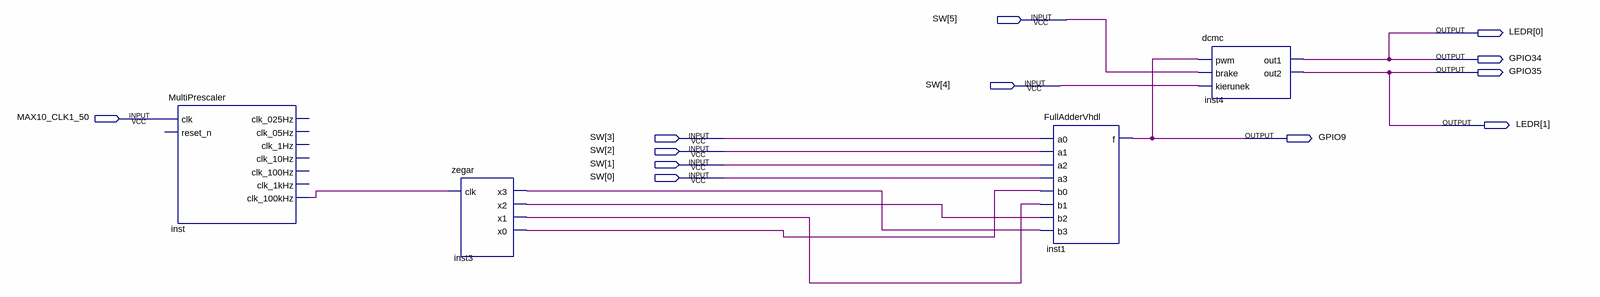
[diagram p0: schematic sheet]
// Quartus schematic PWM.bdf as structural Verilog: 4 symbols, 12 pins
module PWM (
  input  [5:0] SW,
  input  MAX10_CLK1_50,
  output [1:0] LEDR,
  output GPIO34,
  output GPIO35,
  output GPIO9
);

  wire inst3_x0, inst3_x1, inst3_x2, inst3_x3, inst_clk_100khz;

  MultiPrescaler inst (
    .clk(MAX10_CLK1_50), .clk_100kHz(inst_clk_100khz));  // open: reset_n, clk_025Hz, clk_05Hz, clk_1Hz, clk_10Hz, clk_100Hz, clk_1kHz
  zegar inst3 (.clk(inst_clk_100khz), .x3(inst3_x3), .x2(inst3_x2), .x1(inst3_x1), .x0(inst3_x0));
  FullAdderVhdl inst1 (
    .a0(SW[3]), .a1(SW[2]), .a2(SW[1]), .a3(SW[0]), .b0(inst3_x0), .b1(inst3_x1), .b2(inst3_x2),
    .b3(inst3_x3), .f(GPIO9));
  dcmc inst4 (.pwm(GPIO9), .brake(SW[5]), .kierunek(SW[4]), .out1(GPIO34), .out2(GPIO35));

  assign LEDR = {GPIO35, GPIO34};
endmodule
